# EAGLE design Wave Fold Osc CTRL V2 (EAGLE 7.7.0)
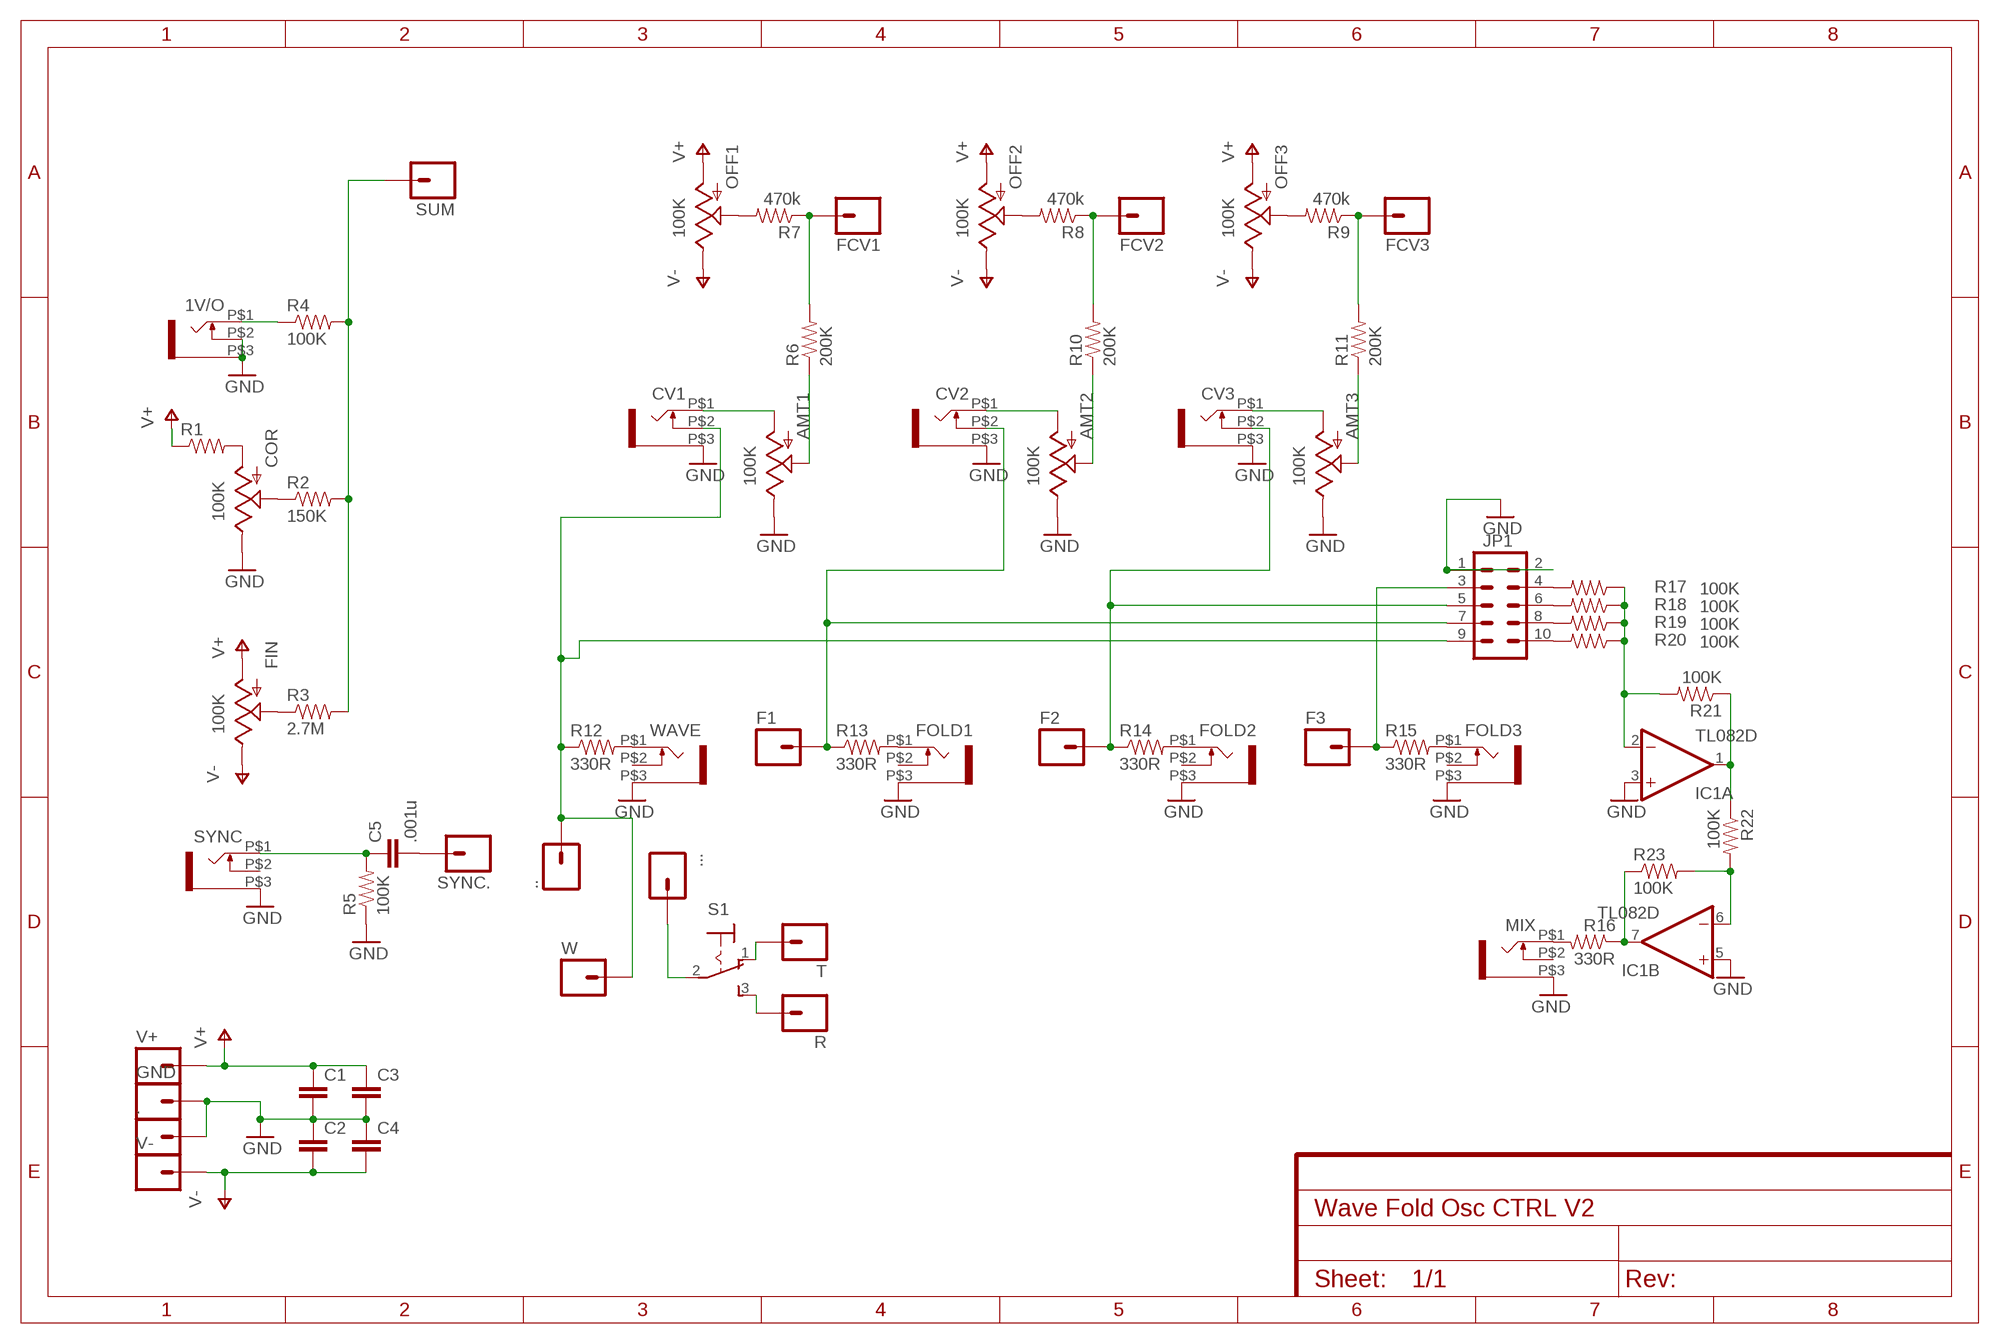
[diagram p0: schematic, sheet 1]

## Parts
1V/O  WQP-PJ301M-12_JACK  [WQP-PJ301M-12_JACK]
.  M01PTH  [1X01]
..  M01PTH  [1X01]
...  M01PTH  [1X01]
AMT1  100K  POT  [ALPS_POT]
AMT2  100K  POT  [ALPS_POT]
AMT3  100K  POT  [ALPS_POT]
C1  CAP0805  [0805]
C2  CAP0805  [0805]
C3  CAP0805  [0805]
C4  CAP0805  [0805]
C5  .001u  CAP0805  [0805]
COR  100K  POT  [ALPS_POT]
CV1  WQP-PJ301M-12_JACK  [WQP-PJ301M-12_JACK]
CV2  WQP-PJ301M-12_JACK  [WQP-PJ301M-12_JACK]
CV3  WQP-PJ301M-12_JACK  [WQP-PJ301M-12_JACK]
F1  M01PTH  [1X01]
F2  M01PTH  [1X01]
F3  M01PTH  [1X01]
FCV1  M01PTH  [1X01]
FCV2  M01PTH  [1X01]
FCV3  M01PTH  [1X01]
FIN  100K  POT  [ALPS_POT]
FOLD1  WQP-PJ301M-12_JACK  [WQP-PJ301M-12_JACK]
FOLD2  WQP-PJ301M-12_JACK  [WQP-PJ301M-12_JACK]
FOLD3  WQP-PJ301M-12_JACK  [WQP-PJ301M-12_JACK]
GND  M01PTH  [1X01]
IC1  TL082D  [SO08]
JP1  M05X2NO_SILK  [2X5_NOSILK]
MIX  WQP-PJ301M-12_JACK  [WQP-PJ301M-12_JACK]
OFF1  100K  POT  [ALPS_POT]
OFF2  100K  POT  [ALPS_POT]
OFF3  100K  POT  [ALPS_POT]
R  M01PTH  [1X01]
R1  RESISTOR0805-RES  [0805]
R2  150K  RESISTOR0805-RES  [0805]
R3  2.7M  RESISTOR0805-RES  [0805]
R4  100K  RESISTOR0805-RES  [0805]
R5  100K  RESISTOR0805-RES  [0805]
R6  200K  RESISTOR0805-RES  [0805]
R7  470k  RESISTOR0805-RES  [0805]
R8  470k  RESISTOR0805-RES  [0805]
R9  470k  RESISTOR0805-RES  [0805]
R10  200K  RESISTOR0805-RES  [0805]
R11  200K  RESISTOR0805-RES  [0805]
R12  330R  RESISTOR0805-RES  [0805]
R13  330R  RESISTOR0805-RES  [0805]
R14  330R  RESISTOR0805-RES  [0805]
R15  330R  RESISTOR0805-RES  [0805]
R16  330R  RESISTOR0805-RES  [0805]
R17  100K  RESISTOR0805-RES  [0805]
R18  100K  RESISTOR0805-RES  [0805]
R19  100K  RESISTOR0805-RES  [0805]
R20  100K  RESISTOR0805-RES  [0805]
R21  100K  RESISTOR0805-RES  [0805]
R22  100K  RESISTOR0805-RES  [0805]
R23  100K  RESISTOR0805-RES  [0805]
S1  M9040P  [M9040P]
SUM  M01PTH  [1X01]
SYNC  WQP-PJ301M-12_JACK  [WQP-PJ301M-12_JACK]
SYNC.  M01PTH  [1X01]
T  M01PTH  [1X01]
V+  M01PTH  [1X01]
V-  M01PTH  [1X01]
W  M01PTH  [1X01]
WAVE  WQP-PJ301M-12_JACK  [WQP-PJ301M-12_JACK]

## Nets
GND: 1V/O.P$2 1V/O.P$3 ..1 AMT1.P$1(E) AMT2.P$1(E) AMT3.P$1(E) C1.2 C2.1 C3.2 C4.1 COR.P$1(E) CV1.P$3 CV2.P$3 CV3.P$3 FOLD1.P$3 FOLD2.P$3 FOLD3.P$3 GND.1 IC1.3(A:+IN) IC1.5(B:+IN) JP1.1 JP1.2 MIX.P$3 R5.1 SYNC.P$3 WAVE.P$3
N$1: COR.P$3(A) R1.2
N$2: COR.P$2(S) R2.1
N$3: FIN.P$2(S) R3.1
N$4: 1V/O.P$1 R4.1
N$5: ...1 CV1.P$2 JP1.9 R12.1 W.1
N$6: OFF1.P$2(S) R7.2
N$7: R2.2 R3.2 R4.2 SUM.1
N$8: C5.2 SYNC..1
N$9: AMT1.P$3(A) CV1.P$1
N$10: AMT1.P$2(S) R6.1
N$11: FCV1.1 R6.2 R7.1
N$12: OFF2.P$2(S) R8.2
N$13: OFF3.P$2(S) R9.2
N$14: AMT2.P$3(A) CV2.P$1
N$15: AMT2.P$2(S) R10.1
N$16: FCV2.1 R8.1 R10.2
N$17: AMT3.P$3(A) CV3.P$1
N$18: AMT3.P$2(S) R11.1
N$19: FCV3.1 R9.1 R11.2
N$20: R12.2 WAVE.P$1
N$21: JP1.4 R17.2
N$22: FOLD1.P$1 R13.2
N$23: FOLD2.P$1 R14.2
N$24: FOLD3.P$1 R15.2
N$25: MIX.P$1 R16.2
N$26: JP1.6 R18.2
N$27: JP1.8 R19.2
N$28: JP1.10 R20.2
N$29: IC1.1(A:OUT) R21.1 R22.1
N$30: C5.1 R5.2 SYNC.P$1
N$31: CV2.P$2 F1.1 JP1.7 R13.1
N$32: CV3.P$2 F2.1 JP1.5 R14.1
N$33: F3.1 JP1.3 R15.1
N$34: IC1.2(A:-IN) R17.1 R18.1 R19.1 R20.1 R21.2
N$35: IC1.6(B:-IN) R22.2 R23.2
N$36: IC1.7(B:OUT) R16.1 R23.1
N$37: R.1 S1.3(S)
N$38: S1.1(O) T.1
N$39: ....1 S1.2(P)
V+: C1.1 C3.1 FIN.P$3(A) OFF1.P$3(A) OFF2.P$3(A) OFF3.P$3(A) R1.1 V+.1
V-: C2.2 C4.2 FIN.P$1(E) OFF1.P$1(E) OFF2.P$1(E) OFF3.P$1(E) V-.1
Unconnected: FOLD1.P$2 FOLD2.P$2 FOLD3.P$2 MIX.P$2 SYNC.P$2 WAVE.P$2

## Power pins joined to a net without a drawn wire
V+: IC1.8(P:V+)
V-: IC1.4(P:V-)

## Library data of the parts
1V/O CV1-CV3 FOLD1-FOLD3 MIX SYNC WAVE = thonkiconn:WQP-PJ301M-12_JACK
. .. ... F1-F3 FCV1-FCV3 GND R SUM SYNC. T V+ V- W = SparkFun-Connectors:M01: Header 1 Standard 1-pin 0.1" header. Use with straight break away headers (SKU : PRT-00116), right angle break away headers (PRT-00553), swiss pins (PRT-00743), machine pins (PRT-00117), and female headers (PRT-00115).
AMT1-AMT3 COR FIN OFF1-OFF3 = SparkFun-Electromechanical:POT; PROD_ID: RES-09177
C1-C5 = SparkFun-Passives:CAP: Capacitor Standard 0603 ceramic capacitor, and 0.1" leaded capacitor.
IC1 = linear:TL082: OP AMP Data sheet <http://www.ti.com/lit/ds/symlink/tl084a . pdf>; DATA_SHEET: <a href="http://www.ti.com/lit/ds/symlink/tl084a.pdf"> Data sheet </a>
JP1 = SparkFun-Connectors:M05X2: Header 5x2 Standard 10-pin dual row 0.1" header. Commonly used with AVR-ISP. Use with Spark Fun Electronics SKU: PRT-00778
R1-R23 = SparkFun-Passives:RESISTOR: Resistor Basic schematic elements and footprints for 0603, 1206, and PTH resistors.
S1 = switch:M9040P: TOGGLE SWITCH Marquardt

## Board
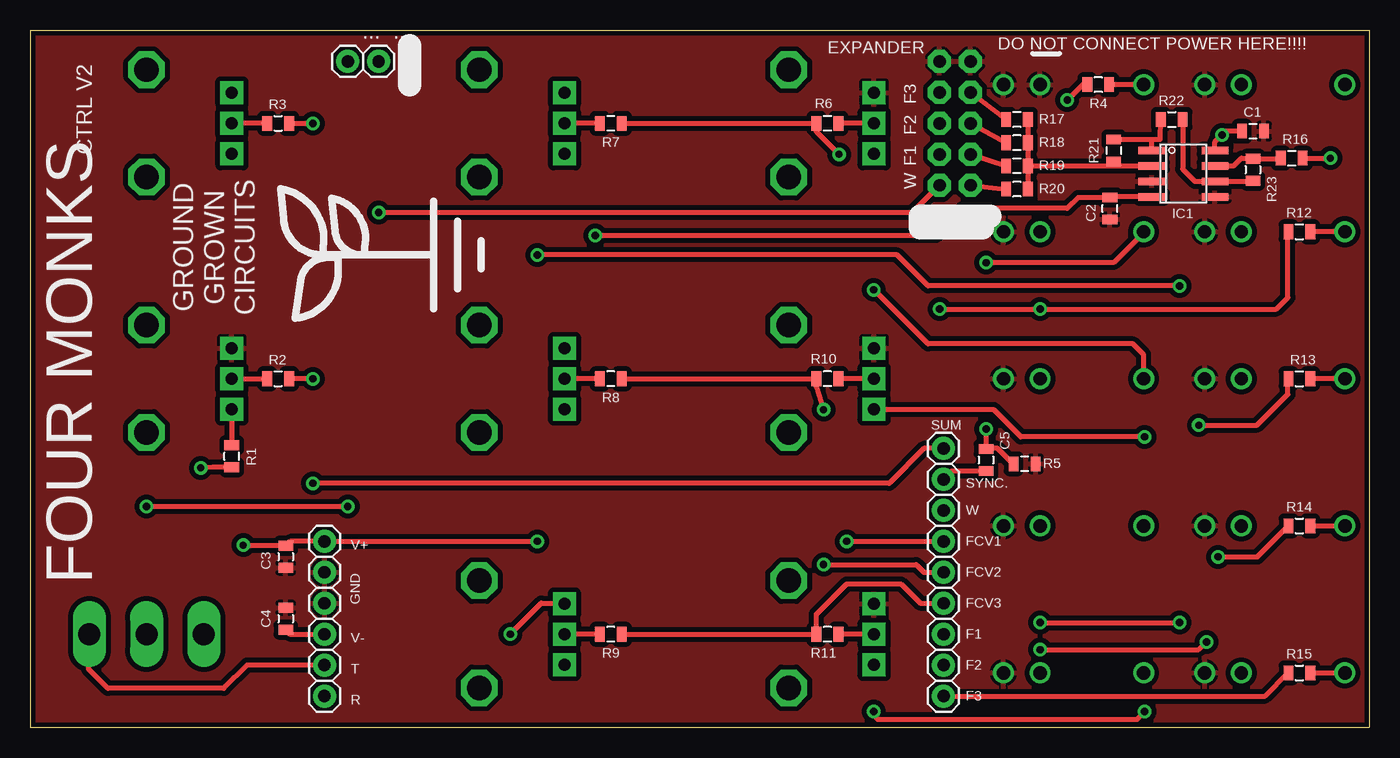
[diagram p1: board, top side]
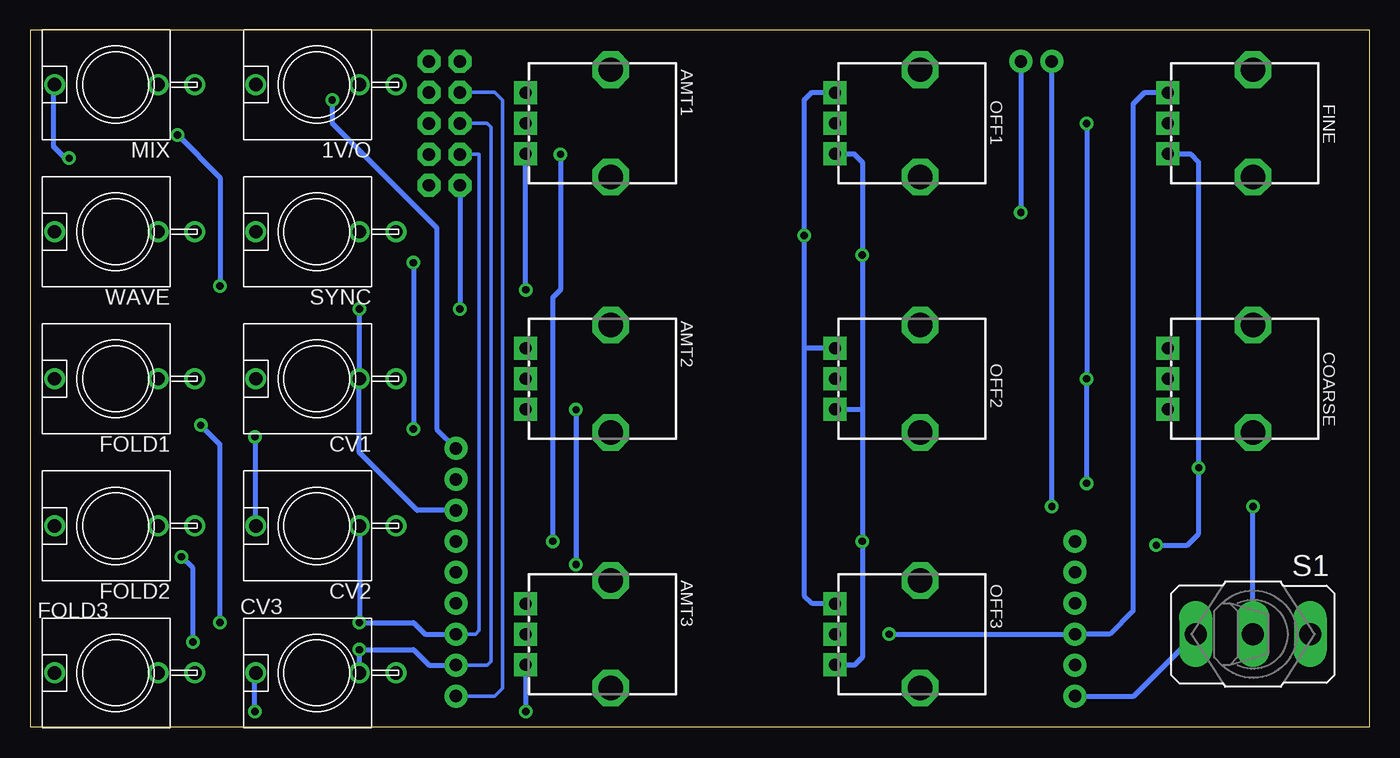
[diagram p2: board, bottom side, seen from below]

Size 109.86 x 57.15 mm. Coordinates in mm from the lower left corner, seen from the top.
Outline: 0,0 109.86,0 109.86,57.15 0,57.15 0,0
Copper layers (1*16): Top 0.035mm / dielectric 1.5mm / Bottom 0.035mm
Design rules "SparkFun": minimum track width 8mil, minimum drill 20mil, track to track 8mil, track to pad 8mil, pad to pad 8mil, via to via 8mil, smd to smd 8mil, copper to edge 8mil, drill to drill 8mil, minimum pad ring 12mil, minimum via ring 10mil, stop-mask expansion 4mil, vias tented up to drill 20mil, thermal gap 10mil

### Footprints (pad centres in the part's own frame; a part is rotated, then mirrored left to right if it is on the bottom)
WQP-PJ301M-12_JACK = drill 1.1: P$1 0,5; P$2 0,-3.5; P$3 0,-6.5
1X01 = drill 1.016 pad 1.88: 1 0,0
ALPS_POT = drill 1 pad 1.88 square: P$1 7,-2.5; P$2 7,0; P$3 7,2.5 | drill 2 octagon: P$4 0,-4.4; P$5 0,4.4
0805 = smd 0.8 x 1.2: 1 -0.9,0; 2 0.9,0
SO08 = smd 0.6 x 2.2: 1 -1.905,-2.6; 2 -0.635,-2.6; 3 0.635,-2.6; 4 1.905,-2.6; 5 1.905,2.6; 6 0.635,2.6; 7 -0.635,2.6; 8 -1.905,2.6
2X5_NOSILK = drill 1.016 pad 1.88 octagon: 1 -1.27,5.08; 2 1.27,5.08; 3 -1.27,2.54; 4 1.27,2.54; 5 -1.27,0; 6 1.27,0; 7 -1.27,-2.54; 8 1.27,-2.54; 9 -1.27,-5.08; 10 1.27,-5.08
M9040P = drill 1.803 long: 1 0,4.699; 2 0,0; 3 0,-4.699

### Placement (x,y rotation side)
1V/O  86.36,52.7 90 bottom
.  24.13,12.7 0 top
..  28.57,54.61 0 top
...  26.04,54.61 0 top
AMT1  62.23,49.53 180 bottom
AMT2  62.23,28.57 180 bottom
AMT3  62.23,7.62 180 bottom
C1  100.33,48.9 0 top
C2  88.58,42.55 90 top
C3  20.95,13.97 270 top
C4  20.95,8.89 270 top
C5  78.42,21.91 270 top
COR  9.53,28.57 180 bottom
CV1  86.36,28.57 90 bottom
CV2  86.36,16.51 90 bottom
CV3  86.36,4.45 90 bottom
F1  74.93,7.62 0 top
F2  74.93,5.08 0 top
F3  74.93,2.54 0 top
FCV1  74.93,15.24 0 top
FCV2  74.93,12.7 0 top
FCV3  74.93,10.16 0 top
FIN  9.53,49.53 180 bottom
FOLD1  102.87,28.57 90 bottom
FOLD2  102.87,16.51 90 bottom
FOLD3  102.87,4.45 90 bottom
GND  24.13,10.16 0 top
IC1  94.61,45.4 270 top
JP1  75.88,49.53 0 top
MIX  102.87,52.7 90 bottom
OFF1  36.83,49.53 180 bottom
OFF2  36.83,28.57 180 bottom
OFF3  36.83,7.62 180 bottom
R  24.13,2.54 0 top
R1  16.51,22.23 90 top
R2  20.32,28.57 0 top
R3  20.32,49.53 0 top
R4  87.63,52.7 180 top
R5  81.6,21.59 180 top
R6  65.41,49.53 180 top
R7  47.62,49.53 180 top
R8  47.62,28.57 180 top
R9  47.62,7.62 180 top
R10  65.41,28.57 180 top
R11  65.41,7.62 180 top
R12  104.14,40.64 0 top
R13  104.14,28.57 0 top
R14  104.14,16.51 0 top
R15  104.14,4.45 0 top
R16  103.5,46.67 0 top
R17  80.96,49.85 180 top
R18  80.96,47.94 180 top
R19  80.96,46.04 180 top
R20  80.96,44.13 180 top
R21  88.9,47.31 270 top
R22  93.66,49.85 0 top
R23  100.33,45.72 270 top
S1  9.53,7.62 270 bottom
SUM  74.93,22.86 0 top
SYNC  86.36,40.64 90 bottom
SYNC.  74.93,20.32 0 top
T  24.13,5.08 0 top
U$2  [LOGO_LARGE]  33.02,38.73 90 top
V+  24.13,15.24 0 top
V-  24.13,7.62 0 top
W  74.93,17.78 0 top
WAVE  102.87,40.64 90 bottom

### Tracks (layer width: path | path; a pad name or v marks a point on that pad's centre or on a via)
GND
  pour Top (isolate 0.406): 0,0 0,57.15 109.86,57.15 109.86,0
N$1
  Top 0.406: COR.P$3 16.52,23.14 R1.2
N$2
  Top 0.406: COR.P$2 R2.1
N$3
  Top 0.406: R3.1 FIN.P$2
N$4
  Top 0.406: 1V/O.P$1 R4.1
N$5  (via drill 0.6)
  Top 0.406: R12.1 103.19,40.59 103.19,35.24 102.23,34.29 v82.87,34.29 v74.61,34.29 | v28.57,42.23 72.39,42.23 JP1.9
  Bottom 0.406: v82.87,34.29 v82.86,34.28 CV1.P$2 82.87,22.54 78.11,17.78 W.1 | JP1.9 v74.61,34.29 | ...1 v28.57,42.23
N$6
  Top 0.406: R7.2 OFF1.P$2
N$7  (via drill 0.6)
  Top 0.406: R3.2 v23.18,49.53 | v23.18,28.57 R2.2 | SUM.1 73.34,22.86 70.48,20 v23.18,20 | R4.2 86.36,52.7 v85.09,51.44
  Bottom 0.406: v23.18,49.53 v23.18,28.57 v23.18,20 | v85.09,51.44 85.09,49.53 76.52,40.96 76.52,24.45 SUM.1
N$8
  Top 0.406: C5.2 75.62,21.01 SYNC..1
N$9  (via drill 0.6)
  Top 0.406: CV1.P$1 91.36,30.56 90.49,31.43 73.66,31.43 v69.22,35.88
  Bottom 0.406: v69.22,35.88 69.22,47.02 AMT1.P$3
N$10
  Top 0.406: AMT1.P$2 R6.1
N$11  (via drill 0.6)
  Top 0.406: R7.1 R6.2 64.5,48.84 v66.36,46.99 | v66.99,15.24 FCV1.1
  Bottom 0.406: v66.36,46.99 66.36,35.88 66.99,35.24 v66.99,15.24
N$12
  Top 0.406: R8.2 OFF2.P$2
N$13
  Top 0.406: R9.2 OFF3.P$2
N$14  (via drill 0.6)
  Top 0.406: v91.44,23.81 81.28,23.81 79.06,26.04 69.27,26.04 AMT2.P$3
  Bottom 0.406: CV2.P$1 91.36,23.73 v91.44,23.81
N$15
  Top 0.406: AMT2.P$2 R10.1
N$16  (via drill 0.6)
  Top 0.406: R8.1 R10.2 64.5,27.89 v65.09,26.04 | v65.09,13.34 72.71,13.34 73.34,12.7 FCV2.1
  Bottom 0.406: v65.09,26.04 v65.09,13.34
N$17  (via drill 0.6)
  Top 0.406: v69.22,1.27 69.22,0.95 69.53,0.64 90.81,0.64 v91.44,1.27
  Bottom 0.406: AMT3.P$3 69.23,1.28 v69.22,1.27 | v91.44,1.27 91.44,4.37 CV3.P$1
N$18
  Top 0.406: AMT3.P$2 R11.1
N$19
  Top 0.406: R9.1 R11.2 64.5,9.26 66.99,11.75 71.44,11.75 73.03,10.16 FCV3.1
N$20
  Top 0.406: WAVE.P$1 R12.2
N$21
  Top 0.406: JP1.4 R17.2
N$22
  Top 0.406: FOLD1.P$1 R13.2
N$23
  Top 0.406: R14.2 FOLD2.P$1
N$24
  Top 0.406: R15.2 FOLD3.P$1
N$25  (via drill 0.6)
  Top 0.406: R16.2 v106.68,46.67
  Bottom 0.406: v106.68,46.67 107,46.67 107.95,47.62 107.95,52.62 MIX.P$1
N$26
  Top 0.406: JP1.6 R18.2
N$27
  Top 0.406: JP1.8 R19.2
N$28
  Top 0.406: JP1.10 R20.2
N$29
  Top 0.406: R21.1 92.08,48.21 | 92.08,48.21 92.71,48.21 R22.1 | IC1.1 92.02,48.15 92.08,48.21
N$30  (via drill 0.6)
  Top 0.406: SYNC.P$1 91.36,40.56 88.9,38.1 v78.42,38.1 | v78.42,24.45 C5.1 78.47,22.86 79.38,22.86 80.64,21.59 R5.2
  Bottom 0.406: v78.42,38.1 v78.42,24.45
N$31  (via drill 0.6)
  Top 0.406: v82.87,8.57 v94.3,8.57 | v95.89,24.77 100.65,24.77 103.19,27.3 103.19,28.52 R13.1
  Bottom 0.305: JP1.7 73.03,46.99 73.03,7.94 73.34,7.62 F1.1
  Bottom 0.406: v94.3,8.57 94.3,23.18 v95.89,24.77 | CV2.P$2 v82.86,8.58 v82.87,8.57 78.42,8.57 77.47,7.62 F1.1
N$32  (via drill 0.6)
  Top 0.406: 103.19,16.46 R14.1 100.7,13.97 v97.47,13.97 | v82.86,6.34 v82.87,6.35 95.89,6.35 v96.52,6.99
  Bottom 0.305: JP1.5 72.39,49.53 72.07,49.21 72.07,5.4 72.39,5.08 F2.1
  Bottom 0.406: F2.1 77.15,5.08 78.42,6.35 v82.87,6.35 v82.86,6.34 CV3.P$2 | v96.52,6.99 96.52,13.02 v97.47,13.97
N$33
  Top 0.406: F3.1 101.33,2.54 R15.1
  Bottom 0.305: JP1.3 71.75,52.07 71.12,51.44 71.12,3.17 71.75,2.54 F3.1
N$34
  Top 0.406: R17.1 R18.1 R19.1 | R19.1 R20.1 | R19.1 88.9,46.04 | 88.9,46.04 IC1.2 | R21.2 88.9,46.04
N$35
  Top 0.406: R22.2 94.56,45.77 95.57,44.77 IC1.6 100.28,44.77 R23.2
N$36
  Top 0.406: IC1.7 98.74,46.04 99.38,46.67 100.28,46.67 R23.1 102.55,46.62 R16.1
N$37
  Bottom 0.406: R.1 19.3,2.54 S1.3
N$38
  Top 0.406: T.1 17.78,5.08 15.88,3.17 6.35,3.17 4.76,4.76 4.76,7.56 S1.1
N$39  (via drill 0.6)
  Top 0.406: v9.53,18.1 v26.04,18.1
  Bottom 0.406: S1.2 v9.53,18.1 | v26.04,18.1 ....1
V+  (via drill 0.6)
  Top 0.406: v41.59,15.24 V+.1 21.32,15.24 C3.1 17.46,14.87 v17.46,14.92 | R1.1 14.97,21.32 v13.97,21.27 | IC1.8 97.22,48 v97.79,48.58 98.11,48.9 C1.1 | v94.3,36.2 73.66,36.2 71.12,38.73 v41.59,38.73
  Bottom 0.406: OFF1.P$3 42.27,47.03 41.59,46.35 v41.59,38.73 41.59,26.04 | 41.59,26.04 v41.59,15.24 41.59,5.71 42.23,5.08 43.79,5.08 OFF3.P$3 | OFF2.P$3 41.63,26.07 41.59,26.04 | v17.46,14.92 14.92,14.92 13.97,15.88 13.97,21.59 | 13.97,21.59 13.97,46.35 14.61,46.99 16.48,46.99 FIN.P$3 | v13.97,21.27 14.29,21.27 13.97,21.59 | v97.79,48.58 94.3,45.09 v94.3,36.2
V-  (via drill 0.6)
  Top 0.406: C4.2 20.95,7.94 21.27,7.62 V-.1 | v39.37,7.62 41.91,10.16 43.79,10.16 OFF3.P$1 | IC1.4 88.64,43.5 C2.2 85.99,43.45 85.09,42.55 76.52,42.55 74.3,40.32 v46.35,40.32
  Bottom 0.406: FIN.P$1 18.45,52.03 19.37,51.12 19.37,9.53 21.27,7.62 V-.1 v39.37,7.62 | OFF1.P$1 45.76,52.03 46.35,51.44 v46.35,40.32 46.35,31.11 | 46.35,31.11 46.35,10.79 45.72,10.16 43.87,10.16 OFF3.P$1 | OFF2.P$1 46.31,31.07 46.35,31.11

### Text on the board
tPlace: DO NOT CONNECT POWER HERE!!!! | EXPANDER | F3 | F2 | CTRL V2 | F1 | W | GROUND / GROWN / CIRCUITS | FOUR MONKS
bPlace: AMT1 | FINE | OFF1 | AMT2 | COARSE | OFF2 | OFF3 | AMT3